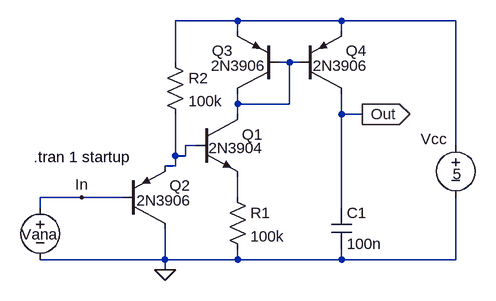
[diagram p0: schematic 4qAdc.asc]
4qAdc.asc, the LTspice schematic file:
Version 4
SHEET 1 880 680
WIRE -304 256 -304 240
WIRE -240 240 -304 240
WIRE -176 240 -240 240
WIRE -112 336 -304 336
WIRE -112 336 -112 288
WIRE -112 352 -112 336
WIRE -96 32 -96 -32
WIRE -96 176 -96 112
WIRE -96 192 -112 192
WIRE -96 192 -96 176
WIRE -80 176 -96 176
WIRE -80 176 -80 160
WIRE -64 160 -80 160
WIRE 0 -32 -96 -32
WIRE 0 -16 0 -32
WIRE 0 96 0 80
WIRE 0 112 0 96
WIRE 0 240 0 208
WIRE 0 336 -112 336
WIRE 0 336 0 320
WIRE 80 32 64 32
WIRE 80 96 0 96
WIRE 80 96 80 32
WIRE 96 32 80 32
WIRE 160 -32 0 -32
WIRE 160 -16 160 -32
WIRE 160 112 160 80
WIRE 160 256 160 112
WIRE 160 336 0 336
WIRE 160 336 160 320
WIRE 192 112 160 112
WIRE 336 -32 160 -32
WIRE 336 160 336 -32
WIRE 336 336 160 336
WIRE 336 336 336 240
FLAG -112 352 0
FLAG 192 112 Out
IOPIN 192 112 Out
FLAG -240 240 In
SYMBOL npn2 -64 112 R0
WINDOW 0 71 31 Left 0
WINDOW 3 19 52 Left 0
SYMATTR InstName Q1
SYMATTR Value 2N3904
SYMBOL pnp2 -176 288 M180
WINDOW 0 71 66 Left 0
WINDOW 3 20 43 Left 0
SYMATTR InstName Q2
SYMATTR Value 2N3906
SYMBOL res -16 224 R0
SYMATTR InstName R1
SYMATTR Value 100k
SYMBOL pnp2 64 80 R180
WINDOW 0 71 66 Left 0
WINDOW 3 20 43 Left 0
SYMATTR InstName Q3
SYMATTR Value 2N3906
SYMBOL pnp2 96 80 M180
WINDOW 0 71 66 Left 0
WINDOW 3 20 43 Left 0
SYMATTR InstName Q4
SYMATTR Value 2N3906
SYMBOL cap 144 256 R0
SYMATTR InstName C1
SYMATTR Value 100n
SYMBOL res -112 16 R0
SYMATTR InstName R2
SYMATTR Value 100k
SYMBOL voltage 336 144 R0
WINDOW 0 -54 6 Left 0
WINDOW 3 -5 60 Left 0
SYMATTR InstName Vcc
SYMATTR Value 5
SYMBOL voltage -304 240 R0
WINDOW 0 -29 57 Left 0
WINDOW 3 -5 60 Invisible 0
WINDOW 123 0 0 Left 0
WINDOW 39 0 0 Left 0
SYMATTR InstName Vana
SYMATTR Value PULSE(0 1 0 .5 .5 0 1)
TEXT -314 178 Left 0 !.tran 1 startup

The netlist it stands for:
* 4qAdc.asc
Q1 N003 N002 N004 0 2N3904
Q2 0 In N002 0 2N3906
R1 N004 0 100k
Q3 N003 N003 N001 0 2N3906
Q4 Out N003 N001 0 2N3906
C1 Out 0 100n
R2 N001 N002 100k
Vcc N001 0 5
Vana In 0 PULSE(0 1 0 .5 .5 0 1)
.model NPN NPN
.model PNP PNP
.lib standard.bjt
.tran 1 startup
.backanno
.end